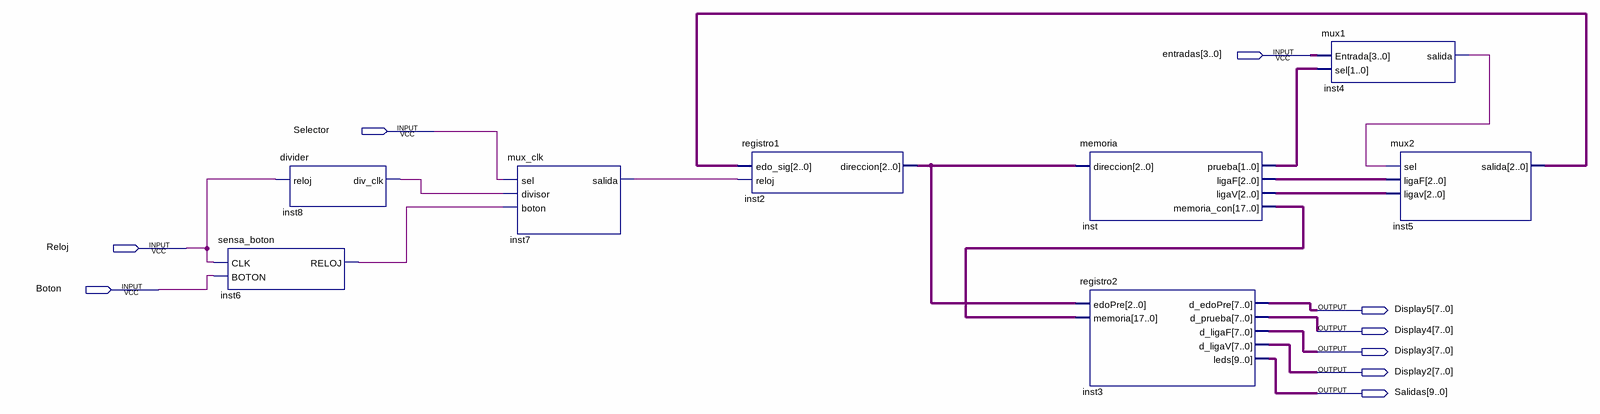
[diagram p0: schematic sheet]
// Quartus schematic practica4.bdf as structural Verilog: 8 symbols, 9 pins
module practica4 (
  input  [3:0] entradas,
  input  Selector,
  input  Reloj,
  input  Boton,
  output [7:0] Display5,
  output [7:0] Display4,
  output [7:0] Display3,
  output [7:0] Display2,
  output [9:0] Salidas
);

  wire inst4_salida, inst6_reloj, inst7_salida, inst8_div_clk;
  wire [1:0] inst_prueba;
  wire [2:0] inst2_direccion, inst5_salida, inst_ligaf, inst_ligav;
  wire [17:0] inst_memoria_con;

  sensa_boton inst6 (.CLK(Reloj), .BOTON(Boton), .RELOJ(inst6_reloj));
  divider inst8 (.reloj(Reloj), .div_clk(inst8_div_clk));
  mux_clk inst7 (.sel(Selector), .divisor(inst8_div_clk), .boton(inst6_reloj), .salida(inst7_salida));
  registro1 inst2 (.edo_sig(inst5_salida), .reloj(inst7_salida), .direccion(inst2_direccion));
  memoria inst (
    .direccion(inst2_direccion), .prueba(inst_prueba), .ligaF(inst_ligaf), .ligaV(inst_ligav),
    .memoria_con(inst_memoria_con));
  registro2 inst3 (
    .edoPre(inst2_direccion), .memoria(inst_memoria_con), .d_edoPre(Display5), .d_prueba(Display4),
    .d_ligaF(Display3), .d_ligaV(Display2), .leds(Salidas));
  mux1 inst4 (.Entrada(entradas), .sel(inst_prueba), .salida(inst4_salida));
  mux2 inst5 (.sel(inst4_salida), .ligaF(inst_ligaf), .ligav(inst_ligav), .salida(inst5_salida));
endmodule
